# EAGLE schematic carbheat (EAGLE 4.16)
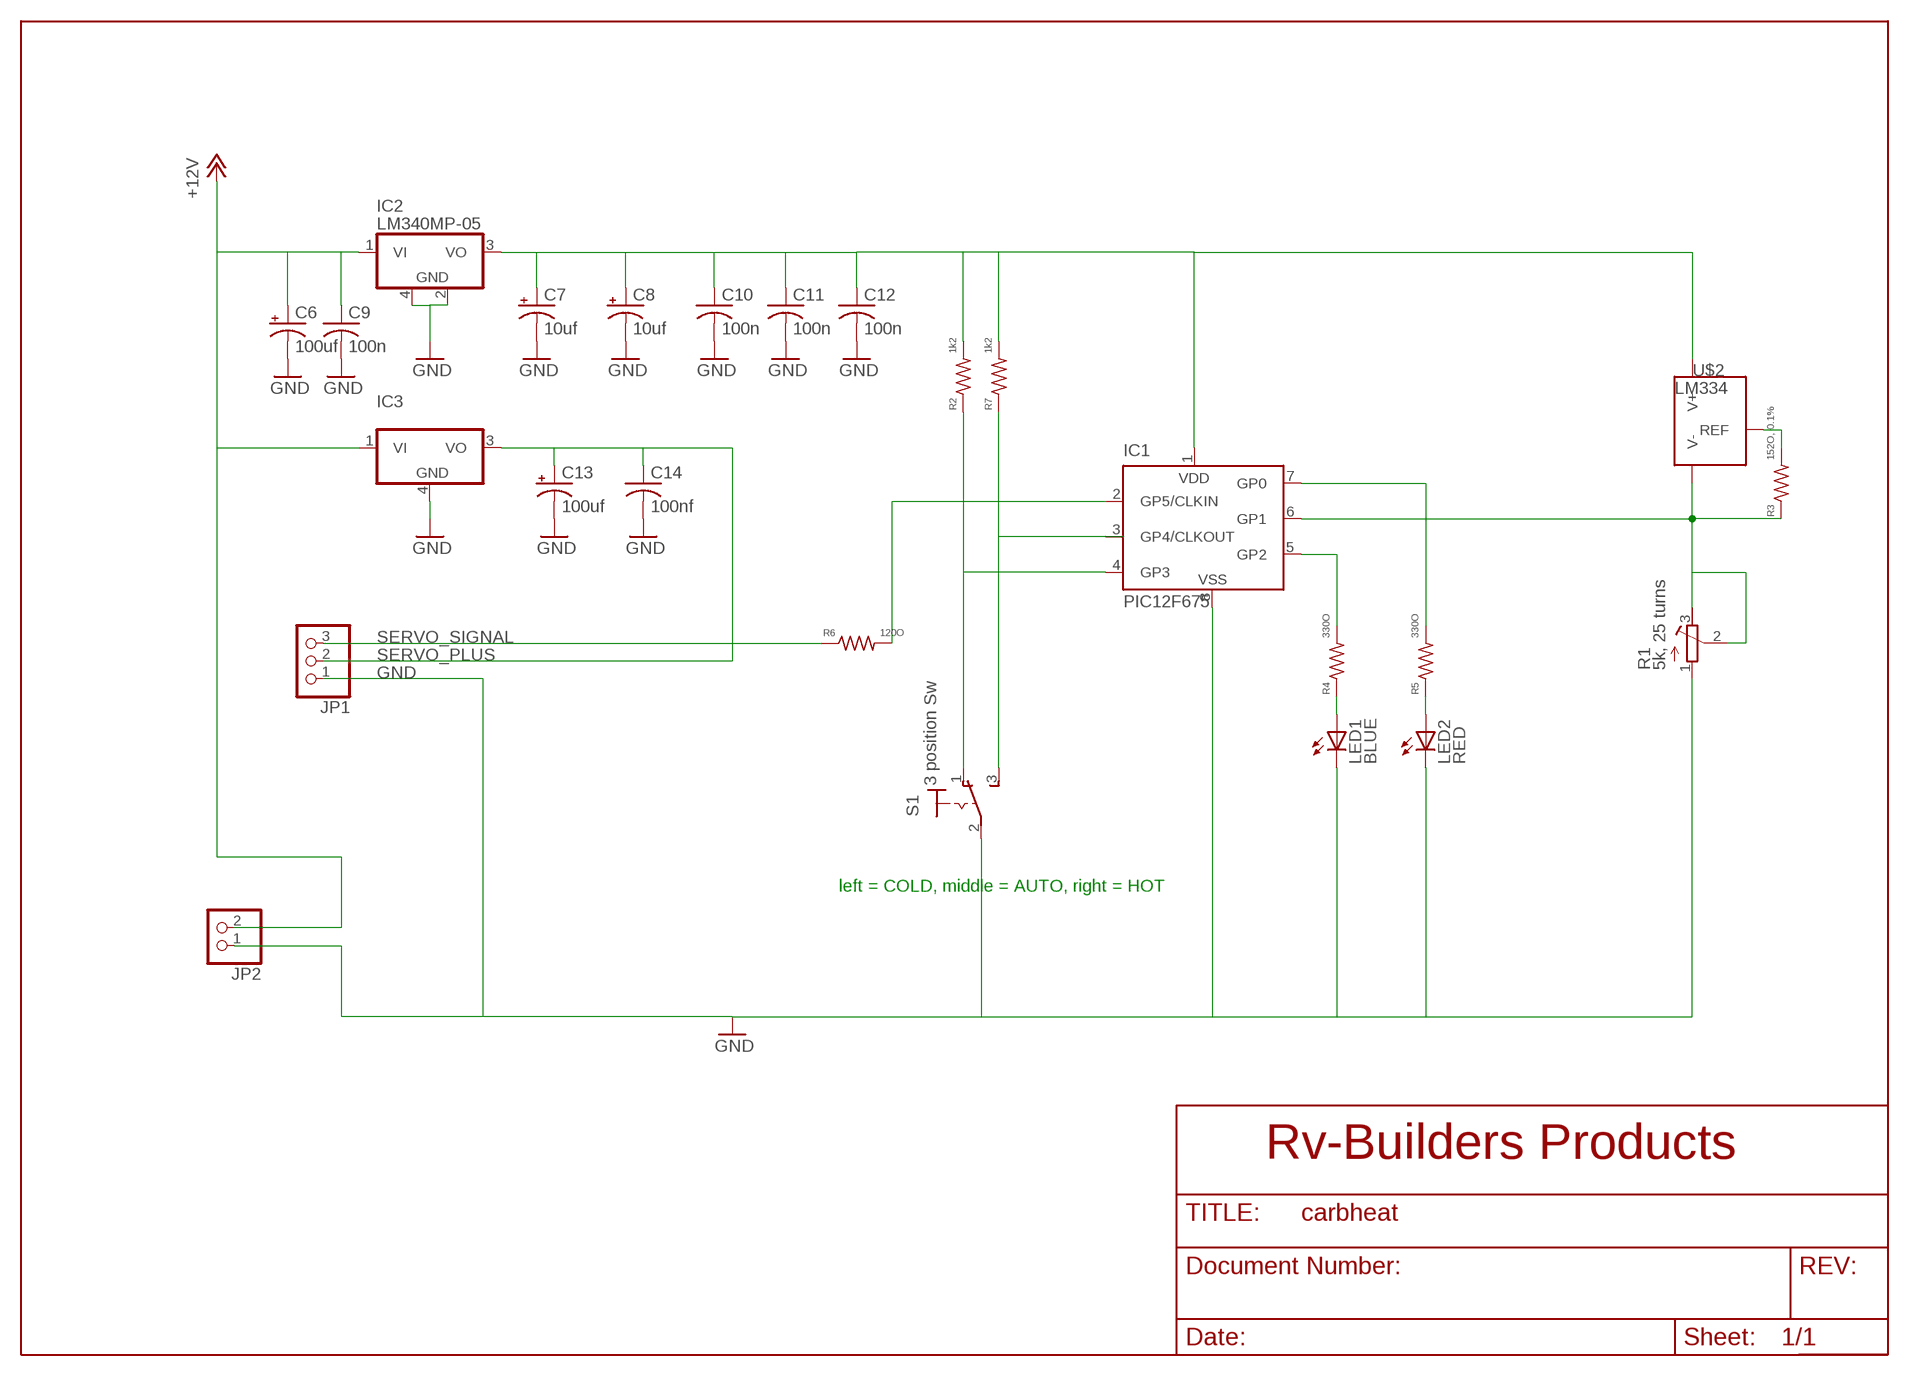
[diagram p0: schematic, sheet 1]

## Parts
C6  100uf  CPOL-USSMCA  [SMC_A]
C7  10uf  CPOL-USSMCA  [SMC_A]
C8  10uf  CPOL-USSMCA  [SMC_A]
C9  100n  C-USC0805  [C0805]
C10  100n  C-USC0805  [C0805]
C11  100n  C-USC0805  [C0805]
C12  100n  C-USC0805  [C0805]
C13  100uf  CPOL-USSMCA  [SMC_A]
C14  100nf  C-USC0805  [C0805]
IC1  PIC12F675  [DFN-S]
IC2  LM340MP-05  [SOT223]
IC3  78MXXL  [DPACK]
JP1  PINHD-1X3  [1X03]
JP2  PINHD-1X2  [1X02]
LED1  BLUE  LED5MM  [LED5MM]
LED2  RED  LED5MM  [LED5MM]
R1  5k, 25 turns  R-TRIMM3296P  [RTRIM3296P]
R2  1k2  R-US_R0805  [R0805]
R3  152O, 0.1%  R-US_R0805  [R0805]
R4  330O  R-US_R0805  [R0805]
R5  330O  R-US_R0805  [R0805]
R6  120O  R-US_R0805  [R0805]
R7  1k2  R-US_R0805  [R0805]
S1  3 position Sw  320-916  [320-916]
U$2  LM334  [TO92-]

## Nets
+12V: C6.+ C9.1 IC2.1(VI) IC3.1(VI) JP2.2
GND: C6.- C7.- C8.- C9.2 C10.2 C11.2 C12.2 C13.- C14.2 IC1.8(VSS) IC2.2(GND1) IC2.4(GND) IC3.4(GND) JP1.1 JP2.1 LED1.K(C) LED2.K(C) R1.1(E) S1.2(P)
N$1: R3.2 U$2.2(REF)
N$2: IC1.6(GP1) R1.2(S) R1.3(A) R3.1 U$2.1(V-)
N$3: C7.+ C8.+ C10.1 C11.1 C12.1 IC1.1(VDD) IC2.3(VO) R2.2 R7.2 U$2.3(V+)
N$5: IC1.7(GP0) R5.2
N$6: IC1.5(GP2) R4.2
N$7: LED1.A R4.1
N$8: LED2.A R5.1
N$10: IC1.2(GP5/CLKIN) R6.2
N$11: IC1.4(GP3) R2.1 S1.1(O)
N$12: IC1.3(GP4/CLKOUT) R7.1 S1.3(S)
SERVO_PLUS: C13.+ C14.1 IC3.3(VO) JP1.2
SERVO_SIGNAL: JP1.3 R6.1

## Notes on the sheet
- left = COLD, middle = AUTO, right = HOT

## Library data of the parts
C6-C8 C13 = rcl:CPOL-US: POLARIZED CAPACITOR, American symbol
C9-C12 C14 = rcl:C-US: CAPACITOR, American symbol
IC1 = microchip:PIC12F6*: Data Sheet 8-Pin FLASH-Based 8-Bit CMOS Microcontrollers Source: http://www.microchip.com .. 41190c.pdf
IC2 = MY_ATMEL:LM340?-*: Positive VOLTAGE REGULATOR Source: http://cache.national.com/ds/LM/LM340.pdf
IC3 = Stofer:78MXXL: VOLTAGE REGULATOR
JP1 = Headers:PINHD-1X3: PIN HEADER
JP2 = Headers:PINHD-1X2: PIN HEADER
LED1 LED2 = led:LED: LED OSRAM: - CHIPLED LG R971, LG N971, LY N971, LG Q971, LY Q971, LO R971, LY R971 LH N974, LH R974 LS Q976, LO Q976, LY Q976 LO Q996 - Hyper CHIPLED LW Q18S LB Q993, LB Q99A, LB R99A - SideLED LS A670, LO A670, LY A670, LG A670, LP A670 LB A673, LV A673, LT A673, LW A673 LH A674 LY A675 LS A676, LA A676, LO A676, LY A676, LW A676 LS A679, LY A679, LG A679 - Hyper Micro SIDELED® LS Y876, LA Y876, LO Y876, LY Y876 LT Y87S - SmartLED LW L88C, LW L88S LB L89C, LB L89S, LG L890 LS L89K, LO L89K, LY L89K LS L896, LA L896, LO L896, LY L896 - TOPLED LS T670, LO T670, LY T670, LG T670, LP T670 LSG T670, LSP T670, LSY T670, LOP T670, LYG T670 LG T671, LOG T671, LSG T671 LB T673, LV T673, LT T673, LW T673 LH T674 LS T676, LA T676, LO T676, LY T676, LB T676, LH T676, LSB T676, LW T676 LB T67C, LV T67C, LT T67C, LS T67K, LO T67K, LY T67K, LW E67C LS E67B, LA E67B, LO E67B, LY E67B, LB E67C, LV E67C, LT E67C LW T67C LS T679, LY T679, LG T679 LS T770, LO T770, LY T770, LG T770, LP T770 LB T773, LV T773, LT T773, LW T773 LH T774 LS E675, LA E675, LY E675, LS T675 LS T776, LA T776, LO T776, LY T776, LB T776 LHGB T686 LT T68C, LB T68C - Hyper Mini TOPLED® LB M676 - Mini TOPLED Santana® LG M470 LS M47K, LO M47K, LY M47K Source: http://www.osram.convergy.de - LUMILED® LXK2-PW12-R00, LXK2-PW12-S00, LXK2-PW14-U00, LXK2-PW14-V00 LXK2-PM12-R00, LXK2-PM12-S00, LXK2-PM14-U00 LXK2-PE12-Q00, LXK2-PE12-R00, LXK2-PE12-S00, LXK2-PE14-T00, LXK2-PE14-U00 LXK2-PB12-K00, LXK2-PB12-L00, LXK2-PB12-M00, LXK2-PB14-N00, LXK2-PB14-P00, LXK2-PB14-Q00 LXK2-PR12-L00, LXK2-PR12-M00, LXK2-PR14-Q00, LXK2-PR14-R00 LXK2-PD12-Q00, LXK2-PD12-R00, LXK2-PD12-S00 LXK2-PH12-R00, LXK2-PH12-S00 LXK2-PL12-P00, LXK2-PL12-Q00, LXK2-PL12-R00 Source: www.luxeon.com
R1 = rcl:R-TRIMM: Trimm resistor
R2-R7 = rcl:R-US_: RESISTOR, American symbol
S1 = switch:320-916: TOGGLE SWITCH distributor RS Components
U$2 = Stofer:LM334